# Altium schematic sheet Sheet3.SchDoc
size C; SheetNumber: 1; SheetTotal: 1
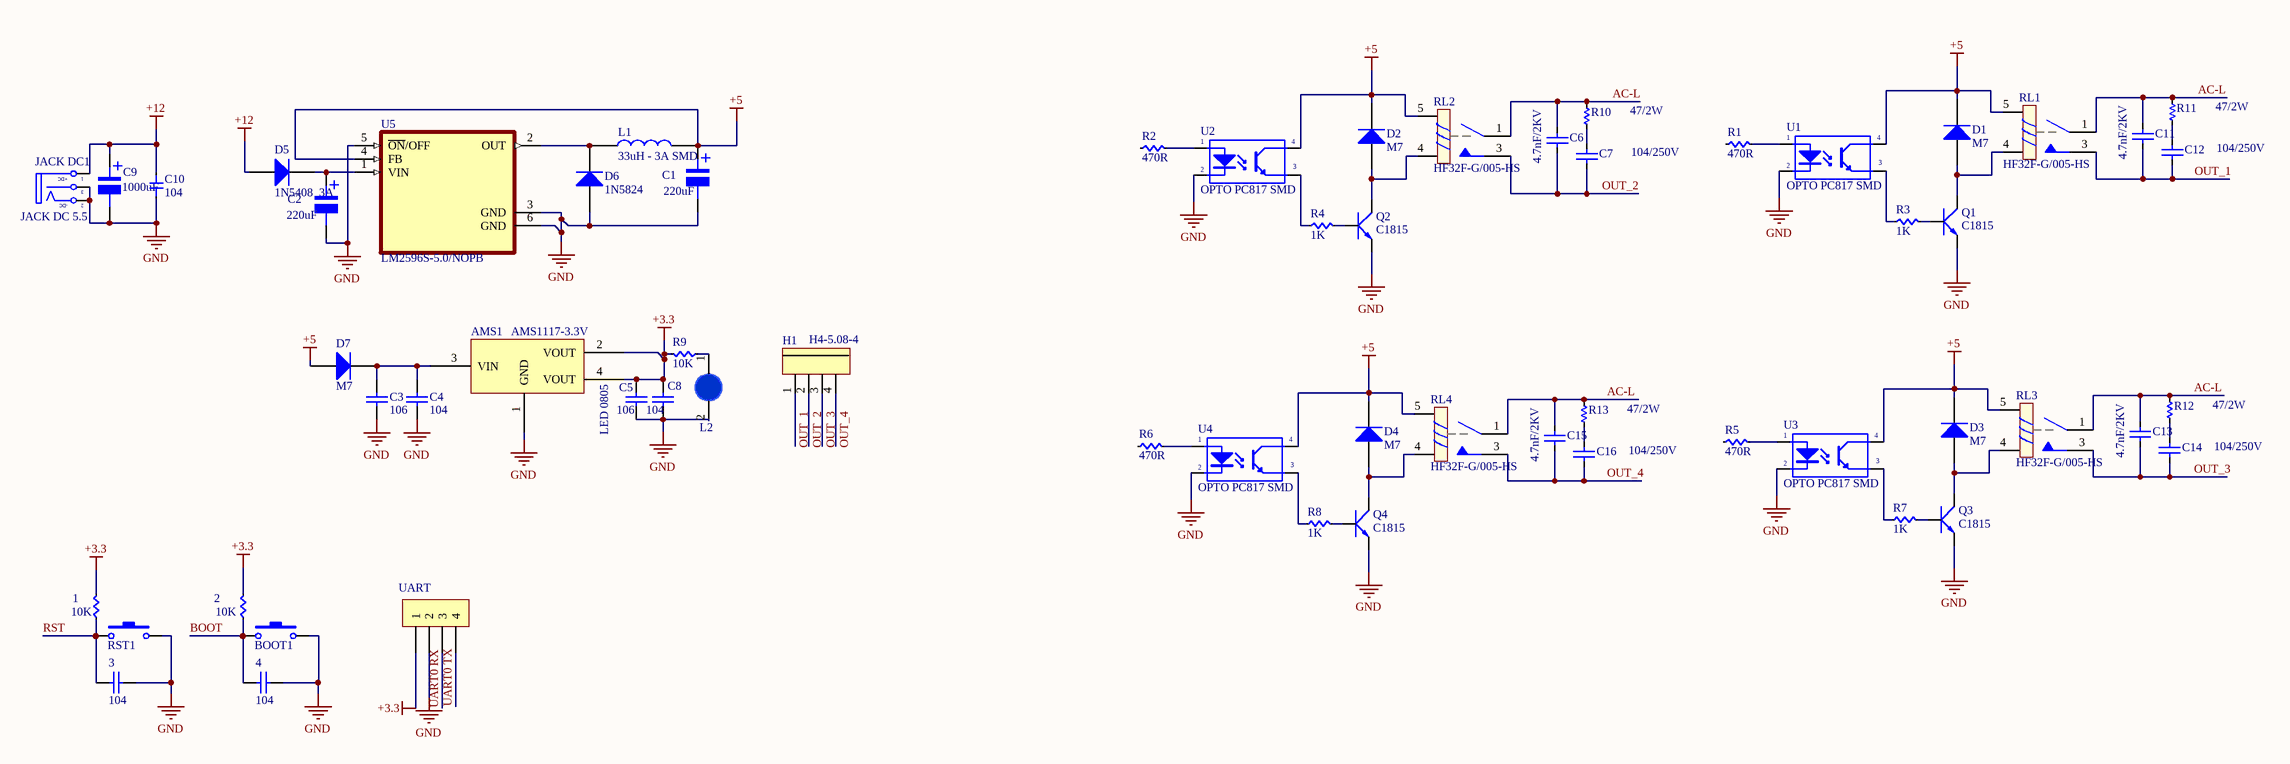
[diagram p0: Sheet3.SchDoc]

## Parts
1  10K  [RES 0805]
2  10K  [RES 0805]
3  104  [tu 0805]
4  104  [tu 0805]
AMS1  AMS1117-3.3V  [SOT223]
BOOT1  Nut Nhan 2 Chan SMD 3x6x2.5  [Nut Nhan 2 Chan SMD 3x6x2.5]  (value not drawn)
C1  220uF  [tu nhom 10 (G)]
C2  220uF  [tu nhom 10 (G)]
C3  106  [tu 0805]
C4  104  [tu 0805]
C5  106  [tu 0805]
C6  4.7nF/2KV  [Cap 6.35mm]
C7  104/250V  [Cap 10mm]
C8  104  [tu 0805]
C9  1000uF  [tu nhom 10 (G)]
C10  104  [Cap 0603]
C11  4.7nF/2KV  [Cap 6.35mm]
C12  104/250V  [Cap 10mm]
C13  4.7nF/2KV  [Cap 6.35mm]
C14  104/250V  [Cap 10mm]
C15  4.7nF/2KV  [Cap 6.35mm]
C16  104/250V  [Cap 10mm]
D1  M7  [DIODE SMA]
D2  M7  [DIODE SMA]
D3  M7  [DIODE SMA]
D4  M7  [DIODE SMA]
D5  1N5408  3A  [DIODE SMA]
D6  1N5824  [DIODE SMA]
D7  M7  [DIODE SMA]
H1  H4-5.08-4  [KF-5.08-4]
H2  UART  [XH2.54M-4]
JACK_DC1  JACK DC 5.5  [JACK DC 5.5]
L1  33uH - 3A SMD  [Cuon Cam 12x12x10]
L2  LED 0805  [LED-0805-Blue]
Q1  C1815  [QTO-92]
Q2  C1815  [QTO-92]
Q3  C1815  [QTO-92]
Q4  C1815  [QTO-92]
R1  470R  [RES 0805]
R2  470R  [RES 0805]
R3  1K  [RES 0805]
R4  1K  [RES 0805]
R5  470R  [RES 0805]
R6  470R  [RES 0805]
R7  1K  [RES 0805]
R8  1K  [RES 0805]
R9  10K  [RES 0805]
R10  47/2W  [RES-1W]
R11  47/2W  [RES-1W]
R12  47/2W  [RES-1W]
R13  47/2W  [RES-1W]
RL1  HF32F-G/005-HS  [HF32F-G]
RL2  HF32F-G/005-HS  [HF32F-G]
RL3  HF32F-G/005-HS  [HF32F-G]
RL4  HF32F-G/005-HS  [HF32F-G]
RST1  Nut Nhan 2 Chan SMD 3x6x2.5  [Nut Nhan 2 Chan SMD 3x6x2.5]  (value not drawn)
U1  OPTO PC817 SMD  [SOP4]
U2  OPTO PC817 SMD  [SOP4]
U3  OPTO PC817 SMD  [SOP4]
U4  OPTO PC817 SMD  [SOP4]
U5  LM2596S-5.0/NOPB  [VREG_LM2596S-12/NOPB]

## Nets
+3.3: 1.2 2.2 AMS1.2(VOUT) AMS1.4(VOUT) C5.1 C8.1 H2.1 R9.2
+5: C1.1 D1.2(K) D2.2(K) D3.2(K) D4.2(K) D7.1(A) L1.2 RL1.5 RL2.5 RL3.5 RL4.5 U1.4(C) U2.4(C) U3.4(C) U4.4(C) U5.4(FB)
+12: C9.1 C10.1 D5.1(A) JACK_DC1.1(T)
GND: 3.2 4.2 AMS1.1(GND) BOOT1.2 C1.2 C2.2 C3.2 C4.2 C5.2 C8.2 C9.2 C10.2 D6.1(A) H2.2 JACK_DC1.2(TN) JACK_DC1.3(S) L2.2(K) Q1.1(E) Q2.1(E) Q3.1(E) Q4.1(E) RST1.2 U1.2(K) U2.2(K) U3.2(K) U4.2(K) U5.3(GND) U5.5(~{ON}/OFF) U5.6(GND)
AC-L: C6.1 C11.1 C13.1 C15.1 R10.1 R11.1 R12.1 R13.1 RL1.1 RL2.1 RL3.1 RL4.1
BOOT: 2.1 4.1 BOOT1.1
OUT_1: C11.2 C12.1 H1.1 RL1.3
OUT_2: C6.2 C7.1 H1.2 RL2.3
OUT_3: C13.2 C14.1 H1.3 RL3.3
OUT_4: C15.2 C16.1 H1.4 RL4.3
RST: 1.1 3.1 RST1.1
UART0 RX: H2.3
UART0 TX: H2.4
NetAMS1_3: AMS1.3(VIN) C3.1 C4.1 D7.2(K)
NetC2_1: C2.1 D5.2(K) U5.1(VIN)
NetC7_2: C7.2 R10.2
NetC12_2: C12.2 R11.2
NetC14_2: C14.2 R12.2
NetC16_2: C16.2 R13.2
NetD1_1: D1.1(A) Q1.2(C) RL1.4
NetD2_1: D2.1(A) Q2.2(C) RL2.4
NetD3_1: D3.1(A) Q3.2(C) RL3.4
NetD4_1: D4.1(A) Q4.2(C) RL4.4
NetD6_2: D6.2(K) L1.1 U5.2(OUT)
NetL2_1: L2.1(A) R9.1
NetQ1_3: Q1.3(B) R3.2
NetQ2_3: Q2.3(B) R4.2
NetQ3_3: Q3.3(B) R7.2
NetQ4_3: Q4.3(B) R8.2
NetR1_2: R1.2 U1.1(A)
NetR2_2: R2.2 U2.1(A)
NetR3_1: R3.1 U1.3(E)
NetR4_1: R4.1 U2.3(E)
NetR5_2: R5.2 U3.1(A)
NetR6_2: R6.2 U4.1(A)
NetR7_1: R7.1 U3.3(E)
NetR8_1: R8.1 U4.3(E)

Not connected (* = marked no-connect by the designer): R1 1; R2 1; R5 1; R6 1

## Notes on the sheet
- (in symbol JACK DC 5.5) +DC; -DC
- (in symbol Tu Nhom 470uF 35V) +
- (in symbol Tu Nhom 1000uF 10V) +

## Library data of the parts
1 2 R9 = RES 0805: RES SMD 0805; Manufacturer: Vishay Dale; Manufacturer Part Number: CRCW040210K0FKED; Tolerance: ±1%; Power (Watts): 0.063W, 1/16W; Temperature Coefficient: ±100ppm/°C; Supplier 1: Digi-Key; RoHS: RoHS Compliant; Category: Resistors; Stock 1: 2392462; Pricing 1: 10=0.083, 50=0.0444, 200=0.0255, 1000=0.0174 (USD); Packaging: Cut Tape (CT); Resistance (Ohms): 10k; Composition: Thick Film; Features: Automotive AEC-Q200; Operating Temperature: -55°C ~ 155°C; Package / Case: 0402 (1005 Metric); Supplier Device Package: 0402 (1005 Metric); Size / Dimension: 0.039" L x 0.020" W (1.00mm x 0.50mm); Height: 0.016" (0.40mm); Number of Terminations: 2; ComponentLink1URL: http://www.vishay.com/docs/20035/dcrcwe3.pdf; ComponentLink1Description: http://www.vishay.com/docs/20035/dcrcwe3.pdf; Supplier Part Number 1: 541-10.0KLCT-ND
3 4 C4 = Tu 0805 104 50V 10%: Dán; Don_Vi: Con; So_Chan: 2; Ten_Linh_Kien: Tụ 0805 104-100nF 10% 50V; Ma_Hang: MH004551; Chung_Loai: Dán; Kieu_Chan: *
AMS1 = AMS1117 SMD: Dán; Value: AMS1117-3.3V SOT223; Don_Vi: Con; Ma_Hang: MH000596; Ghi_Chu: *; Kieu_Chan: *; Chung_Loai: Dán
BOOT1 RST1 = Nut Nhan 2 Chan SMD 3x6x2.5: Ma_Hang: MH001036; Ten: Nút Nhấn 2 Chân 3x6x2.5MM SMD
C1 C2 = Tu Nhom 470uF 35V: Dán; Don_Vi: Con; So_Chan: 2; Ten_Linh_Kien: Tụ Nhôm 470uF 35V 10x10.5MM; Ma_Hang: MH004418; Chung_Loai: Dán; Kieu_Chan: *
C3 C5 C8 = Tu 0805 106 16V 10%: Dán; Ten_Linh_Kien: Tụ 0805 106-10uF 10% 16V; So_Chan: 2; Don_Vi: Con; Ma_Hang: MH004553; Chung_Loai: Dán; Kieu_Chan: *
C6 C7 C11-C16 = CN: Capacitor
C9 = Tu Nhom 1000uF 10V: Dán; So_Chan: 2; Don_Vi: Con; Ten_Linh_Kien: Tụ Nhôm 1000uF 10V; Ma_Hang: MH007515; Chung_Loai: Dán; Kieu_Chan: *
C10 = Cap 0603: Capacitor SMD 0603
D1-D5 D7 = Diode M7 ( 4007 ): Dán; Don_Vi: Con; Ten_Linh_Kien: Diode M7 1N4007 SMD 1A 1000V; Ma_Hang: MH000944; Chung_Loai: Dán; Ghi_Chu: *
D6 = Diode SS34 ( 1N5822 ): Dán; Don_Vi: Con; Ma_Hang: MH002104; Ten_Linh_Kien: Diode SS34 3A 40V SMA ( 1N5822 SS34A); Kieu_Chan: *; Chung_Loai: Dán
H1 = KF-5.08-4-R Cong
H2 = Header 4P 2.54 Duc Thang: Cắm; Ten_Linh_Kien: Header 4P XH2.54-4P Đực Thẳng; Don_Vi: Con; Ma_Hang: MH001285; Chung_Loai: Cắm
JACK_DC1 = JACK DC 5.5: Value: Jac DC
L1 = CUON CAM 100uH SMD: Dán; Don_Vi: Con; Ma_Hang: MH003999; Ten_Linh_Kien: Cuộn Cảm 100uH 7x7x4MM CD74; Ma_Hang: *; Kieu_Chan: *; Chung_Loai: Dán
L2 = LED 0805 Xanh Duong: Dán; Don_Vi: Con; Ma_Hang: MH002327; Ten_Linh_Kien: LED 0805 Màu Xanh Dương (Blue); Ghi_Chu: *; Kieu_Chan: *; Chung_Loai: Dán
Q1-Q4 = C1815: NPN 600mW, ECB; Value: C1815
R1-R8 = RES 0805: RES SMD 0805; Manufacturer: Vishay Dale; Manufacturer Part Number: CRCW040210K0FKED; Resistance (Ohms): 10k; Tolerance: ±1%; Power (Watts): 0.063W, 1/16W; Temperature Coefficient: ±100ppm/°C; Supplier 1: Digi-Key; RoHS: RoHS Compliant; Category: Resistors; Stock 1: 2392462; Pricing 1: 10=0.083, 50=0.0444, 200=0.0255, 1000=0.0174 (USD); Packaging: Cut Tape (CT); Composition: Thick Film; Features: Automotive AEC-Q200; Operating Temperature: -55°C ~ 155°C; Package / Case: 0402 (1005 Metric); Supplier Device Package: 0402 (1005 Metric); Size / Dimension: 0.039" L x 0.020" W (1.00mm x 0.50mm); Height: 0.016" (0.40mm); Number of Terminations: 2; ComponentLink1URL: http://www.vishay.com/docs/20035/dcrcwe3.pdf; ComponentLink1Description: http://www.vishay.com/docs/20035/dcrcwe3.pdf; Supplier Part Number 1: 541-10.0KLCT-ND
R10-R13 = Res
RL1-RL4 = Relay HF 10A: Relay hongfa 10A 4P HF32F-G/005-HS; ComponentLink1Description: Datasheet; ComponentLink1URL: https://pdf1.alldatasheet.com/datasheet-pdf/view/312455/HONGFA/HF32F-G/005-HXXX.html
U1-U4 = OPTO PC817 SMD: Single Opto; Value: PC817
U5 = LM2596S-12/NOPB: SIMPLE SWITCHERÂ® 4.5V to 40V, 3A Low Component Count Step-Down Regulator; MF: Texas Instruments; SnapEDA_Link: https://www.snapeda.com/parts/LM2596S-12/NOPB/Texas+Instruments/view-part/?ref=snap; Package: TO-263-5 Texas Instruments; Value: *; MP: LM2596S-12/NOPB; Check_prices: https://www.snapeda.com/parts/LM2596S-12/NOPB/Texas+Instruments/view-part/?ref=eda